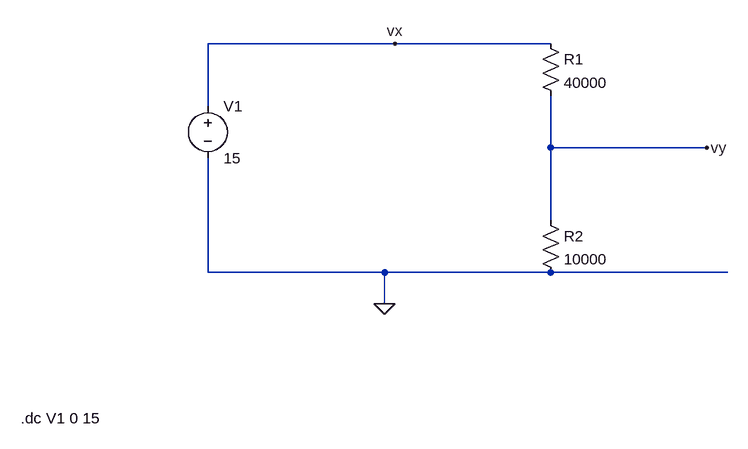
[diagram p0: schematic 15v_5v_voltage_devider.asc]
15v_5v_voltage_devider.asc, the LTspice schematic file:
Version 4
SHEET 1 1272 680
WIRE -880 -1504 -1168 -1504
WIRE -640 -1504 -880 -1504
WIRE -1168 -1408 -1168 -1504
WIRE -640 -1344 -640 -1424
WIRE -400 -1344 -640 -1344
WIRE -640 -1232 -640 -1344
WIRE -1168 -1152 -1168 -1328
WIRE -896 -1152 -1168 -1152
WIRE -640 -1152 -896 -1152
WIRE -368 -1152 -640 -1152
WIRE -896 -1104 -896 -1152
FLAG -896 -1104 0
FLAG -880 -1504 vx
FLAG -400 -1344 vy
SYMBOL res -656 -1520 R0
SYMATTR InstName R1
SYMATTR Value 40000
SYMBOL res -656 -1248 R0
SYMATTR InstName R2
SYMATTR Value 10000
SYMBOL voltage -1168 -1424 R0
WINDOW 123 0 0 Left 0
WINDOW 39 0 0 Left 0
SYMATTR InstName V1
SYMATTR Value 15
TEXT -1456 -928 Left 2 !.dc V1 0 15

The netlist it stands for:
* 15v_5v_voltage_devider.asc
R1 vx vy 40000
R2 vy 0 10000
V1 vx 0 15
.dc V1 0 15
.backanno
.end

* Results of the author's LTspice run, read from the files saved beside the schematic
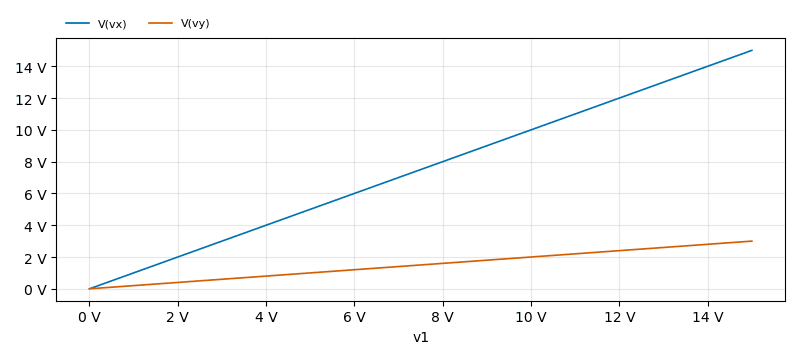
[diagram p1: DC transfer characteristic of 15v_5v_voltage_devider.asc, plotted from the saved traces]
* DC transfer characteristic, 1 run:
*   V(vx): 0 V at v1=0 V, 15 V at v1=15 V, min 0 V, max 15 V
*   V(vy): 0 V at v1=0 V, 3 V at v1=15 V, min 0 V, max 3 V